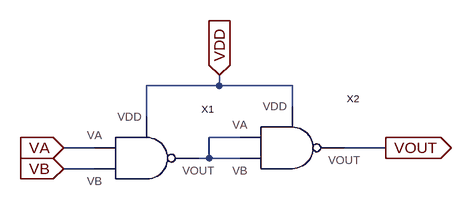
[diagram p0: schematic and.asc]
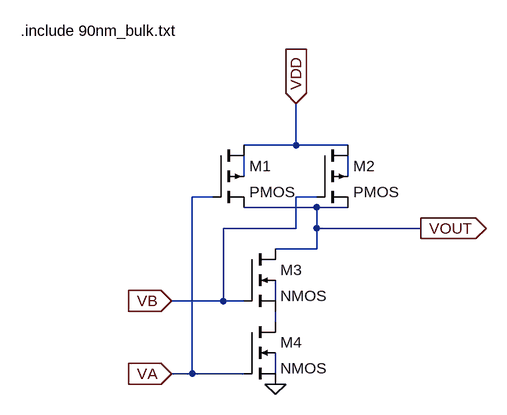
[diagram p1: sub-circuit nand.asc]
and.asc, the LTspice schematic file:
Version 4
SHEET 1 880 680
WIRE 240 32 240 16
WIRE 240 32 128 32
WIRE 352 32 240 32
WIRE 352 64 352 32
WIRE 128 80 128 32
WIRE 272 112 224 112
WIRE 48 128 0 128
WIRE 496 128 432 128
WIRE 224 144 224 112
WIRE 224 144 208 144
WIRE 272 144 224 144
WIRE 48 160 0 160
FLAG 0 160 VB
IOPIN 0 160 In
FLAG 0 128 VA
IOPIN 0 128 In
FLAG 240 16 VDD
IOPIN 240 16 In
FLAG 496 128 VOUT
IOPIN 496 128 Out
SYMBOL nand 336 112 R0
SYMATTR InstName X2
SYMBOL nand 112 128 R0
SYMATTR InstName X1

nand.asc, the sub-circuit schematic file:
Version 4
SHEET 1 880 696
WIRE 496 272 496 208
WIRE 496 272 416 272
WIRE 576 272 496 272
WIRE 416 320 416 288
WIRE 576 320 576 288
WIRE 368 352 336 352
WIRE 528 352 496 352
WIRE 528 368 416 368
WIRE 576 368 528 368
WIRE 496 400 496 352
WIRE 496 400 384 400
WIRE 528 400 528 368
WIRE 688 400 528 400
WIRE 528 432 528 400
WIRE 528 432 464 432
WIRE 384 512 384 400
WIRE 384 512 304 512
WIRE 416 512 384 512
WIRE 464 512 464 480
WIRE 464 544 464 528
WIRE 336 624 336 352
WIRE 336 624 304 624
WIRE 416 624 336 624
WIRE 464 624 464 592
FLAG 304 624 VA
IOPIN 304 624 In
FLAG 304 512 VB
IOPIN 304 512 In
FLAG 496 208 VDD
IOPIN 496 208 In
FLAG 688 400 VOUT
IOPIN 688 400 Out
FLAG 464 640 0
SYMBOL nmos4 416 432 R0
SYMATTR InstName M3
SYMATTR Value2 l=90n w=200n
SYMBOL nmos4 416 544 R0
SYMATTR InstName M4
SYMATTR Value2 l=90n w=200n
SYMBOL pmos4 368 272 R0
SYMATTR InstName M1
SYMATTR Value2 l=90n w=400n
SYMBOL pmos4 528 272 R0
SYMATTR InstName M2
SYMATTR Value2 l=90n w=400n
TEXT 72 96 Left 2 !.include 90nm_bulk.txt

The netlist it stands for:
* and.asc
XX2 N001 N001 VDD VOUT nand
XX1 VA VB VDD N001 nand

* block symbol definitions
.subckt nand VA VB VDD VOUT
M3 VOUT VB N004 N003 NMOS l=90n w=200n
M4 N004 VA 0 N005 NMOS l=90n w=200n
M1 VDD VA VOUT N001 PMOS l=90n w=400n
M2 VDD VB VOUT N002 PMOS l=90n w=400n
.include 90nm_bulk.txt
.ends nand

.model NMOS NMOS
.model PMOS PMOS
.lib standard.mos
.backanno
.end